# Altium schematic sheet Switch.SchDoc
size A
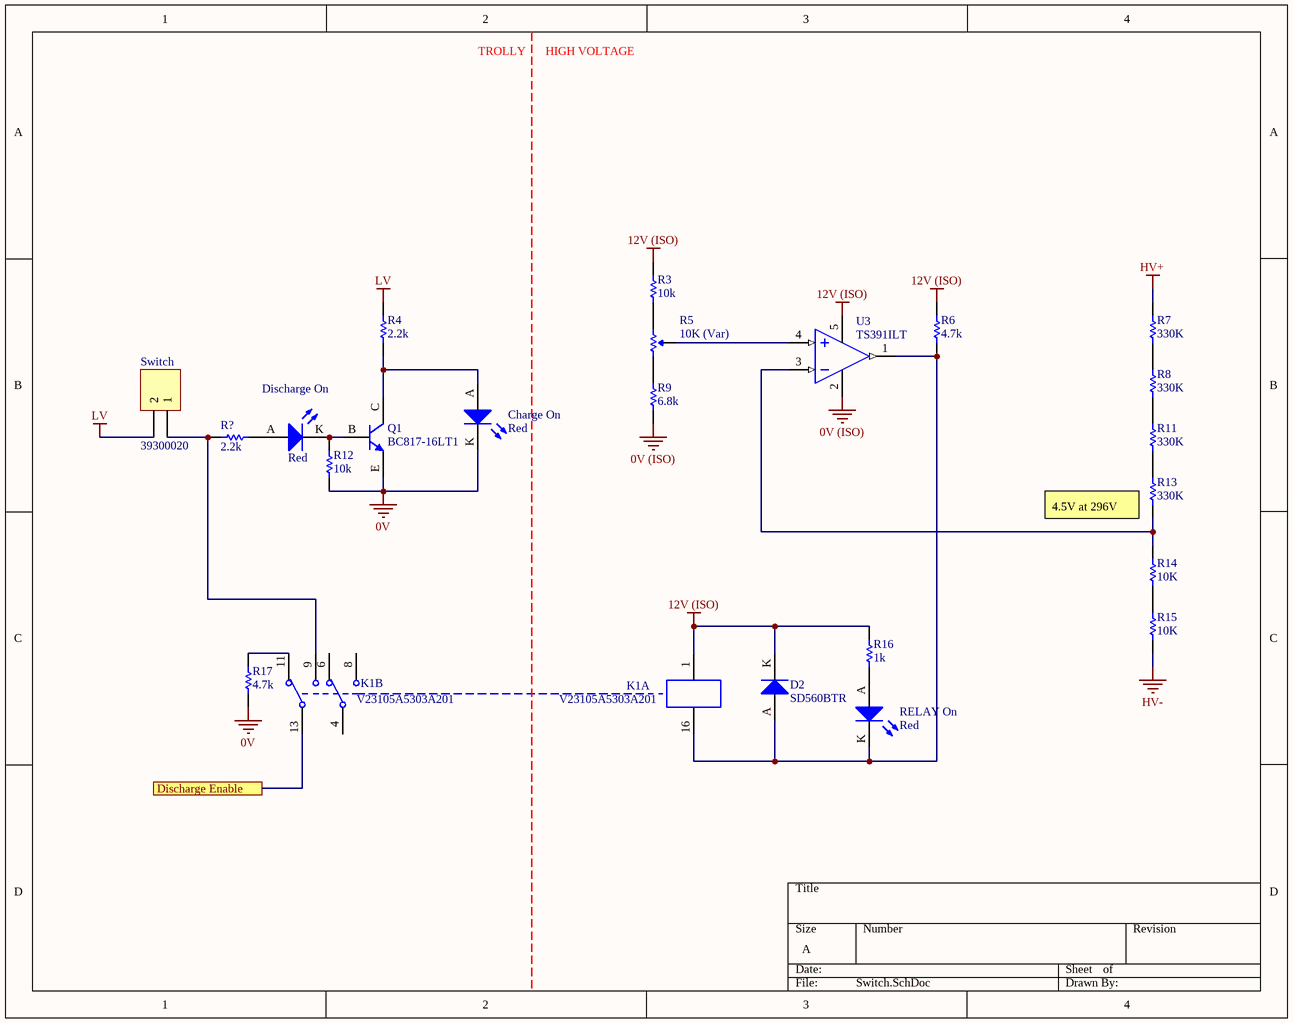
[diagram p0: Switch.SchDoc]

## Parts
Charge_On  Red  [0805 LED]
D2  SD560BTR  [SMB Diode]
Discharge_On  Red  [0805 LED]
K1  V23105A5303A201  [TI 2-DIL]  (parts A,B of 2)
Q1  BC817-16LT1  [ON SOT-23 BJT]
R3  10k  [0805]
R4  2.2k  [0805]
R5  10K (Var)  [B 3296]
R6  4.7k  [0805]
R7  330K  [VB 0204]
R8  330K  [VB 0204]
R9  6.8k  [0805]
R11  330K  [VB 0204]
R12  10k  [0805]
R13  330K  [VB 0204]
R14  10K  [VB 0204]
R15  10K  [VB 0204]
R16  1k  [0805]
R17  4.7k  [0805]
R?  2.2k  [0805]
RELAY_On  Red  [0805 LED]
Switch  39300020  [39300020]
U3  TS391ILT  [ON SOT-23-5]

## Ports
Discharge Enable

## Nets
0V: Charge_On.K Q1.E R12.1 R17.2
0V (ISO): R9.1 U3.2(VCC-)
12V (ISO): D2.K K1.1 R3.2 R6.2 R16.2 U3.5(VCC+)
HV+: R7.2
HV-: R15.1
LV: R4.2 Switch.2
Discharge Enable: K1.13 ; port Discharge Enable
NetCharge_On_A: Charge_On.A Q1.C R4.1
NetD2_A: D2.A K1.16 R6.1 RELAY_On.K U3.1(OUT)
NetDischarge_On_A: Discharge_On.A R?.1
NetDischarge_On_K: Discharge_On.K Q1.B R12.2
NetK1_9: K1.9 R?.2 Switch.1
NetK1_11: K1.11 R17.1
NetR3_1: R3.1 R5.1(CCW)
NetR5_2: R5.2(Wiper) U3.4(IIN+)
NetR5_3: R5.3(CW) R9.2
NetR7_1: R7.1 R8.2
NetR8_1: R8.1 R11.2
NetR11_1: R11.1 R13.2
NetR13_1: R13.1 R14.2 U3.3(IN-)
NetR14_1: R14.1 R15.2
NetR16_1: R16.1 RELAY_On.A

Not connected (* = marked no-connect by the designer): K1 4 6 8

## Notes on the sheet
- TROLLY
- HIGH VOLTAGE
- (near R13) 4.5V at 296V

## Library data of the parts
Charge_On Discharge_On RELAY_On = SML-210LTT86: Red LED Indication - Discrete 1.75V 0805 (2012 Metric); Manufacturer: ROHM Semiconductor; Part Number: SML-210LTT86; Colour: Red; Digikey Part Number: 511-1286-1-ND; Digikey Link: https://www.digikey.com/product-detail/en/rohm-semiconductor/SML-210LTT86/511-1286-1-ND/637099
D2 = SD560BTR: 1.2V_F 600V 5A SMB; Manufacturer: SMC Diode Solutions; Part Number: SD560BTR; Digikey Part Number: 1655-1530-2-ND; Digikey Link: https://www.digikey.com/product-detail/en/smc-diode-solutions/SD560BTR/1655-1530-2-ND/6022620
K1 = V23105A5303A201: RELAY TELECOM DPDT 3A 12V; Manufacturer: TE Connectivity; Part Number: V23105A5303A201; Digikey Part Number: PB387-ND; Digikey Link: https://www.digikey.com/product-detail/en/te-connectivity-potter-brumfield-relays/V23105A5303A201/PB387-ND/291023
Q1 = BC817-16LT1: 300mW  BJT NPN Transistor; Manufacturer: ON Semiconductor; Part Number: BC817-16LT1; Digikey Part Number: BC817-16LT1OSTR-ND; Digikey Link: https://www.digikey.com.au/product-detail/en/on-semiconductor/BC817-16LT1/BC817-16LT1OSTR-ND/606178
R3 R12 = RC0805FR0710KL: Manufacturer: YAGEO; Tolerance: 0.01; Rated Voltage: 0.125W; Part Number: RC0805FR0710KL; Value: 10k; Material: FR-07; Digikey Part Number: 311-10.0KCRCT-ND
R4 R? = RC0805FR072K2L: Manufacturer: YAGEO; Tolerance: 0.01; Rated Voltage: 0.125W; Part Number: RC0805FR072K2L; Value: 2.2k; Material: FR-07; Digikey Part Number: 311-2.20KCRCT-ND
R5 = 3296W-1-103LF: Manufacturer: Bournes Inc; Tolerance: 0.1; Rated Voltage: 0.5W; Part Number: 3296W-1-103LF; Value: 10K (Var); Digikey Part Number: 3296W-103LF-ND
R6 R17 = RC0805FR074K7L: Manufacturer: YAGEO; Tolerance: 0.01; Rated Voltage: 0.125W; Part Number: RC0805FR074K7L; Value: 4.7k; Material: FR-07; Digikey Part Number: 311-4.70KCRCT-ND
R7 R8 R11 R13 = MMA02040C3303FB300: Manufacturer: Vishay Beyschlag; Tolerance: 0.01; Rated Voltage: 0.4W; Part Number: MMA02040C3303FB300; Value: 330K; Digikey Part Number: MMA-330KACT-ND
R9 = RC0805FR076K8L: Manufacturer: YAGEO; Tolerance: 0.01; Rated Voltage: 0.125W; Part Number: RC0805FR076K8L; Value: 6.8k; Material: FR-07; Digikey Part Number: 311-6.80KCRCT-ND
R14 R15 = MMA02040C1002FB300: Manufacturer: Vishay Beyschlag; Tolerance: 0.01; Rated Voltage: 0.4W; Part Number: MMA02040C1002FB300; Value: 10K; Digikey Part Number: MMA-10KACT-ND
R16 = RC0805FR071KL: Manufacturer: YAGEO; Tolerance: 0.01; Rated Voltage: 0.125W; Part Number: RC0805FR071KL; Value: 1k; Material: FR-07; Digikey Part Number: 311-1.00KCRCT-ND
Switch = 39300020: Pitch: 4.2mm; Row Spacing: 5.5mm; Angle: 90; Flange: No; Contact: Tin; Part Number: 39300020; Positions: 2; Digikey Part Number: WM21351-ND
U3 = TS391ILT: IC COMP LO PWR SGL V SOT 23-5L; Manufacturer: STMicroelectronics; Part Number: TS391ILT; Digikey Part Number: 497-2275-2-ND; Digikey Link: https://www.digikey.com/product-detail/en/stmicroelectronics/TS391ILT/497-2275-2-ND/599407